# EAGLE design NT_MCUModule (EAGLE 9.5.1)
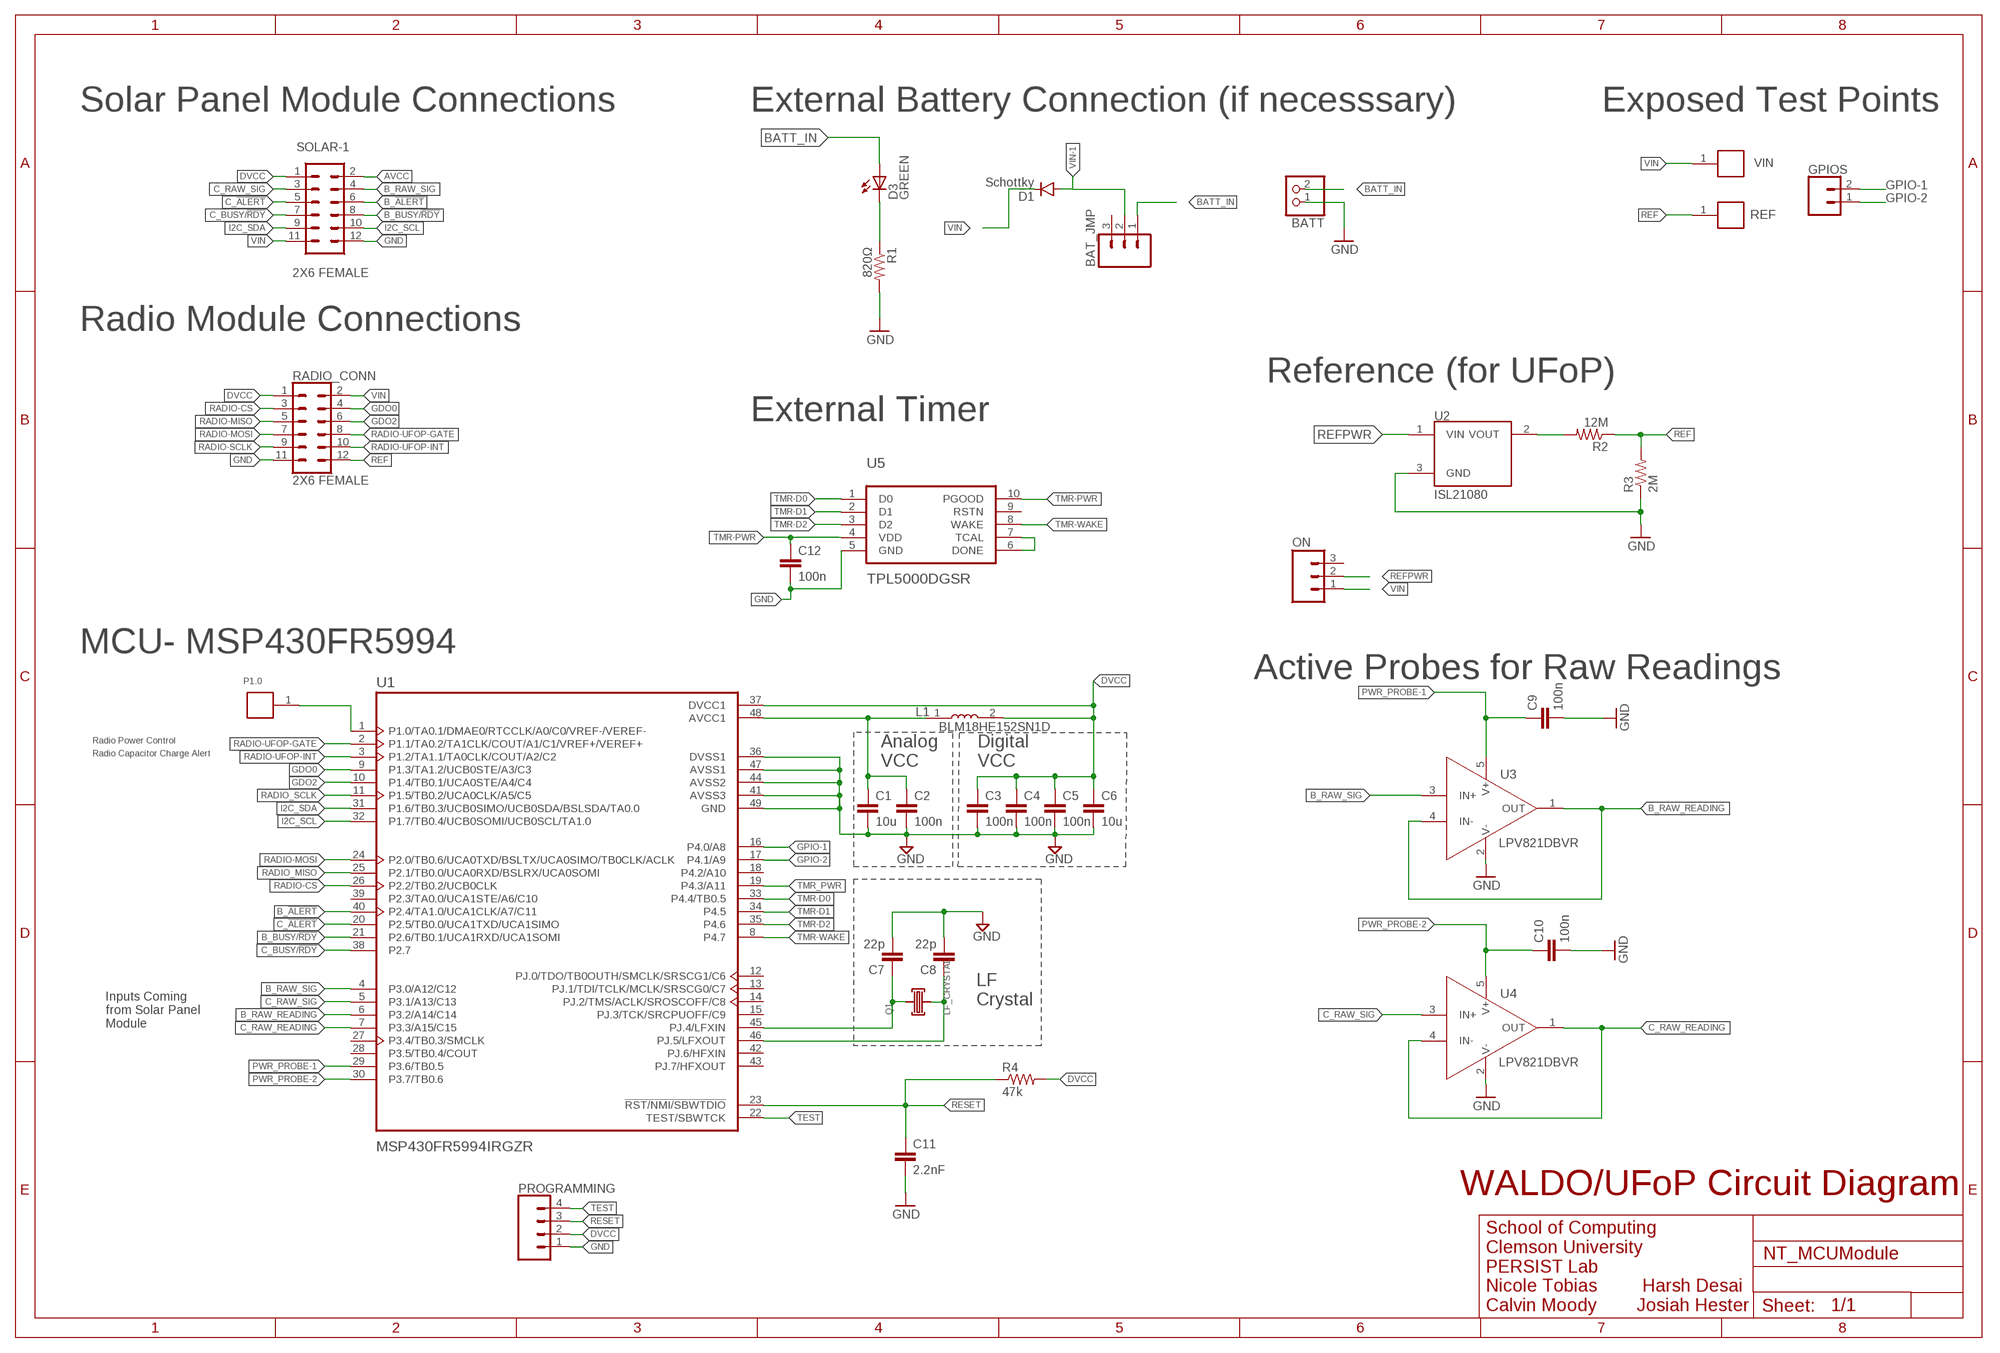
[diagram p0: schematic, sheet 1]

## Parts
BAT_JMP  M03  [1X03-1.27MM]
BATT  PINHD-1X2  [1X02]
C1  10u  C-EUC0603  [C0603]
C2  100n  C-EUC0603  [C0603]
C3  100n  C-EUC0603  [C0603]
C4  100n  C-EUC0603  [C0603]
C5  100n  C-EUC0603  [C0603]
C6  10u  C-EUC0603  [C0603]
C7  22p  C-EUC0603  [C0603]
C8  22p  C-EUC0603  [C0603]
C9  100n  C-EUC0603  [C0603]
C10  100n  C-EUC0603  [C0603]
C11  2.2nF  C-EUC0603  [C0603]
C12  100n  C-EUC0603  [C0603]
D1  Schottky  DIODESOD523  [SOD523]
D3  GREEN  LEDCHIP-LED0805  [CHIP-LED0805]
GPIOS  CONN_02  [1X02]
L1  BLM18HE152SN1D  [INDC1608X95]
ON  M03  [1X03-1.27MM]
P1.0  RCU-0C  [TE_RCU-0C]
PROGRAMMING  CONN_04  [1X04]
Q1  LF_CRYSTAL  [LF_CRYSTAL]
R1  820Ω  RESISTOR0603  [0603-RES]
R2  12M  RESISTOR0603-RES  [0603-RES]
R3  2M  RESISTOR0603-RES  [0603-RES]
R4  47k  RESISTOR0603-RES  [0603-RES]
RADIO_CONN  2X6 FEMALE  CONN_06X2PTH_FEMALE  [2X6]
REF  RCU-0C  [TE_RCU-0C]
SOLAR-1  2X6 FEMALE  M06X2PTH_FEMALE  [2X6]
U1  MSP430FR5994IRGZR  [QFN50P700X700X100-49N]
U2  ISL21080  [SOT-23]
U3  LPV821DBVR  [SOT95P280X145-5N]
U4  LPV821DBVR  [SOT95P280X145-5N]
U5  TPL5000DGSR  [SOP50P490X110-10N]
VIN  RCU-0C  [TE_RCU-0C]

## Nets
AVCC: C1.1 C2.1 L1.1 SOLAR-1.2 U1.48(AVCC1)
B_!ALERT: SOLAR-1.6 U1.40(P2.4/TA1.0/UCA1CLK/A7/C11)
B_BUSY/!RDY: SOLAR-1.8 U1.21(P2.6/TB0.1/UCA1RXD/UCA1SOMI)
B_RAW_READING: U1.6(P3.2/A14/C14) U3.1(OUT) U3.4(IN-)
B_RAW_SIG: SOLAR-1.4 U1.4(P3.0/A12/C12) U3.3(IN+)
BATT_IN: BAT_JMP.1 BATT.2 D3.A
C_!ALERT: SOLAR-1.5 U1.20(P2.5/TB0.0/UCA1TXD/UCA1SIMO)
C_BUSY/!RDY: SOLAR-1.7 U1.38(P2.7)
C_RAW_READING: U1.7(P3.3/A15/C15) U4.1(OUT) U4.4(IN-)
C_RAW_SIG: SOLAR-1.3 U1.5(P3.1/A13/C13) U4.3(IN+)
DVCC: C3.1 C4.1 C5.1 C6.1 L1.2 PROGRAMMING.2 R4.2 RADIO_CONN.1 SOLAR-1.1 U1.37(DVCC1)
GDO0: RADIO_CONN.4 U1.9(P1.3/TA1.2/UCB0STE/A3/C3)
GDO2: RADIO_CONN.6 U1.10(P1.4/TB0.1/UCA0STE/A4/C4)
GND: BATT.1 C1.2 C2.2 C3.2 C4.2 C5.2 C6.2 C7.2 C8.2 C9.2 C10.2 C11.2 C12.2 PROGRAMMING.1 R1.2 R3.1 RADIO_CONN.11 SOLAR-1.12 U1.36(DVSS1) U1.41(AVSS3) U1.44(AVSS2) U1.47(AVSS1) U1.49(GND) U2.3(GND) U3.2(V-) U4.2(V-) U5.5(GND)
GPIO-1: GPIOS.2 U1.16(P4.0/A8)
GPIO-2: GPIOS.1 U1.17(P4.1/A9)
I2C_SCL: SOLAR-1.10 U1.32(P1.7/TB0.4/UCB0SOMI/UCB0SCL/TA1.0)
I2C_SDA: SOLAR-1.9 U1.31(P1.6/TB0.3/UCB0SIMO/UCB0SDA/BSLSDA/TA0.0)
N$1: P1.0.1 U1.1(P1.0/TA0.1/DMAE0/RTCCLK/A0/C0/VREF-/VEREF-)
N$3: U5.6(DONE) U5.7(TCAL)
N$11: D3.C R1.1
N$12: R2.2 U2.2(VOUT)
N$19: C8.1 Q1.2 U1.46(PJ.5/LFXOUT)
N$22: C7.1 Q1.1 U1.45(PJ.4/LFXIN)
PWR_PROBE-1: C9.1 U1.29(P3.6/TB0.5) U3.5(V+)
PWR_PROBE-2: C10.1 U1.30(P3.7/TB0.6) U4.5(V+)
RADIO-CS: RADIO_CONN.3 U1.26(P2.2/TB0.2/UCB0CLK)
RADIO-MISO: RADIO_CONN.5
RADIO-MOSI: RADIO_CONN.7 U1.24(P2.0/TB0.6/UCA0TXD/BSLTX/UCA0SIMO/TB0CLK/ACLK)
RADIO-SCLK: RADIO_CONN.9
RADIO-UFOP-GATE: RADIO_CONN.8 U1.2(P1.1/TA0.2/TA1CLK/COUT/A1/C1/VREF+/VEREF+)
RADIO-UFOP-INT: RADIO_CONN.10 U1.3(P1.2/TA1.1/TA0CLK/COUT/A2/C2)
RADIO_MISO: U1.25(P2.1/TB0.0/UCA0RXD/BSLRX/UCA0SOMI)
RADIO_SCLK: U1.11(P1.5/TB0.2/UCA0CLK/A5/C5)
REF: R2.1 R3.2 RADIO_CONN.12 REF.1
REFPWR: ON.2 U2.1(VIN)
RESET: C11.1 PROGRAMMING.3 R4.1 U1.23(!RST/NMI/SBWTDIO)
TEST: PROGRAMMING.4 U1.22(TEST/SBWTCK)
TMR-D0: U1.33(P4.4/TB0.5) U5.1(D0)
TMR-D1: U1.34(P4.5) U5.2(D1)
TMR-D2: U1.35(P4.6) U5.3(D2)
TMR-PWR: C12.1 U5.4(VDD) U5.10(PGOOD)
TMR-WAKE: U1.8(P4.7) U5.8(WAKE)
TMR_PWR: U1.19(P4.3/A11)
VIN: D1.C ON.1 RADIO_CONN.2 SOLAR-1.11 VIN.1
VIN-1: BAT_JMP.2 D1.A
Unconnected: BAT_JMP.3 ON.3 U1.12(PJ.0/TDO/TB0OUTH/SMCLK/SRSCG1/C6) U1.13(PJ.1/TDI/TCLK/MCLK/SRSCG0/C7) U1.14(PJ.2/TMS/ACLK/SROSCOFF/C8) U1.15(PJ.3/TCK/SRCPUOFF/C9) U1.18(P4.2/A10) U1.27(P3.4/TB0.3/SMCLK) U1.28(P3.5/TB0.4/COUT) U1.39(P2.3/TA0.0/UCA1STE/A6/C10) U1.42(PJ.6/HFXIN) U1.43(PJ.7/HFXOUT) U5.9(RSTN)

## Notes on the sheet
- Solar Panel Module Connections | External Battery Connection (if necesssary) | Exposed Test Points
- Radio Module Connections
- Reference (for UFoP)
- External Timer
- MCU- MSP430FR5994
- Active Probes for Raw Readings
- Radio Power Control
- Analog | Digital
- Radio Capacitor Charge Alert
- VCC | VCC
- LF
- Crystal
- Inputs Coming 
  from Solar Panel
  Module
- WALDO/UFoP Circuit Diagram
- School of Computing
  Clemson University
  PERSIST Lab
  Nicole Tobias         Harsh Desai
  Calvin Moody        Josiah Hester

## Library data of the parts
BAT_JMP ON = SparkFun-Connectors:M03: Header 3 Standard 3-pin 0.1" header. Use with straight break away headers (SKU : PRT-00116), right angle break away headers (PRT-00553), swiss pins (PRT-00743), machine pins (PRT-00117), and female headers (PRT-00115). Molex polarized connector foot print use with SKU : PRT-08232 with associated crimp pins and housings.
BATT = pinhead:PINHD-1X2: PIN HEADER
C1-C12 = rcl:C-EU: CAPACITOR, European symbol
D1 = SparkFun-DiscreteSemi:DIODE: Diode These are standard reverse protection diodes and small signal diodes. SMA package can handle up to about 1A. SOD-323 can handle about 200mA. What the SOD-323 package when ordering, there are some mfgs out there that are 5-pin packages.
D3 = led:LED: LED OSRAM: - CHIPLED LG R971, LG N971, LY N971, LG Q971, LY Q971, LO R971, LY R971 LH N974, LH R974 LS Q976, LO Q976, LY Q976 LO Q996 - Hyper CHIPLED LW Q18S LB Q993, LB Q99A, LB R99A - SideLED LS A670, LO A670, LY A670, LG A670, LP A670 LB A673, LV A673, LT A673, LW A673 LH A674 LY A675 LS A676, LA A676, LO A676, LY A676, LW A676 LS A679, LY A679, LG A679 - Hyper Micro SIDELED® LS Y876, LA Y876, LO Y876, LY Y876 LT Y87S - SmartLED LW L88C, LW L88S LB L89C, LB L89S, LG L890 LS L89K, LO L89K, LY L89K LS L896, LA L896, LO L896, LY L896 - TOPLED LS T670, LO T670, LY T670, LG T670, LP T670 LSG T670, LSP T670, LSY T670, LOP T670, LYG T670 LG T671, LOG T671, LSG T671 LB T673, LV T673, LT T673, LW T673 LH T674 LS T676, LA T676, LO T676, LY T676, LB T676, LH T676, LSB T676, LW T676 LB T67C, LV T67C, LT T67C, LS T67K, LO T67K, LY T67K, LW E67C LS E67B, LA E67B, LO E67B, LY E67B, LB E67C, LV E67C, LT E67C LW T67C LS T679, LY T679, LG T679 LS T770, LO T770, LY T770, LG T770, LP T770 LB T773, LV T773, LT T773, LW T773 LH T774 LS E675, LA E675, LY E675, LS T675 LS T776, LA T776, LO T776, LY T776, LB T776 LHGB T686 LT T68C, LB T68C - Hyper Mini TOPLED® LB M676 - Mini TOPLED Santana® LG M470 LS M47K, LO M47K, LY M47K Source: http://www.osram.convergy.de LUXEON: - LUMILED® LXK2-PW12-R00, LXK2-PW12-S00, LXK2-PW14-U00, LXK2-PW14-V00 LXK2-PM12-R00, LXK2-PM12-S00, LXK2-PM14-U00 LXK2-PE12-Q00, LXK2-PE12-R00, LXK2-PE12-S00, LXK2-PE14-T00, LXK2-PE14-U00 LXK2-PB12-K00, LXK2-PB12-L00, LXK2-PB12-M00, LXK2-PB14-N00, LXK2-PB14-P00, LXK2-PB14-Q00 LXK2-PR12-L00, LXK2-PR12-M00, LXK2-PR14-Q00, LXK2-PR14-R00 LXK2-PD12-Q00, LXK2-PD12-R00, LXK2-PD12-S00 LXK2-PH12-R00, LXK2-PH12-S00 LXK2-PL12-P00, LXK2-PL12-Q00, LXK2-PL12-R00 Source: www.luxeon.com KINGBRIGHT: KA-3528ASYC Source: www.kingbright.com
GPIOS = SparkFun-Connectors:CONN_02: Multi connection point. Often used as Generic Header-pin footprint for 0.1 inch spaced/style header connections On any of the 0.1 inch spaced packages, you can populate with these: Break Away Headers - Straight <https://www.sparkfun.com/products/116> (PRT-00116) Break Away Male Headers - Right Angle <https://www.sparkfun.com/products/553> (PRT-00553) Female Headers <https://www.sparkfun.com/products/115> (PRT-00115) Break Away Headers - Machine Pin <https://www.sparkfun.com/products/117> (PRT-00117) Break Away Female Headers - Swiss Machine Pin <https://www.sparkfun.com/products/743> (PRT-00743) For SCREWTERMINALS and SPRING TERMINALS visit here: Screw Terimnals on SparkFun.com <https://www.sparkfun.com/search/results?term=Screw+Terminals> (5mm/3.5mm/2.54mm spacing) This device is also useful as a general connection point to wire up your design to another part of your project. Our various solder wires solder well into these plated through hole pads. Hook-Up Wire - Assortment (Stranded, 22 AWG) <https://www.sparkfun.com/products/11375> (PRT-11375) Hook-Up Wire - Assortment (Solid Core, 22 AWG) <https://www.sparkfun.com/products/11367> (PRT-11367) View the entire wire category on our website here <https://www.sparkfun.com/categories/141> Special notes: Molex polarized connector foot print use with: PRT-08233 with associated crimp pins and housings. 2.54_SCREWTERM for use with PRT-10571. 3.5mm Screw Terminal footprints for PRT-08084 5mm Screw Terminal footprints for use with PRT-08432
L1 = BLM18HE152SN1D:BLM18HE152SN1D: Ferrite Beads Multi-Layer 1.5KOhm 25% 100MHz 500mA 500mOhm DCR 0603 T/R; DESCRIPTION: Ferrite Beads Multi-Layer 1.5KOhm 25% 100MHz 500mA 500mOhm DCR 0603 Paper T/R; DIGI-KEY_PART_NUMBER: 490-5216-1-ND; DIGI-KEY_PURCHASE_URL: https://www.digikey.com/product-detail/en/murata-electronics-north-america/BLM18HE152SN1D/490-5216-1-ND/1948392?utm_source=snapeda&utm_medium=aggregator&utm_campaign=symbol; MF: Murata; MP: BLM18HE152SN1D; PACKAGE: 0603 Murata
P1.0 REF VIN = RCU-0C:RCU-0C: 0603 PROBE PAD; AVAILABILITY: Unavailable; COMMENT: RCU-0C _1625854-3_; DESCRIPTION: 0603 PROBE PAD; EU_ROHS_COMPLIANCE: Compliant; LINK: http://www.te.com/usa-en/product-1625854-3.html; MF: TE Connectivity; MP: RCU-0C; PACKAGE: 0603; POWER_RATING: 0 W; PRICE: None; RESISTANCE: <.05; TOLERANCE: 0%
PROGRAMMING = SparkFun-Connectors:CONN_04: Multi connection point. Often used as Generic Header-pin footprint for 0.1 inch spaced/style header connections On any of the 0.1 inch spaced packages, you can populate with these: Break Away Headers - Straight <https://www.sparkfun.com/products/116> (PRT-00116) Break Away Male Headers - Right Angle <https://www.sparkfun.com/products/553> (PRT-00553) Female Headers <https://www.sparkfun.com/products/115> (PRT-00115) Break Away Headers - Machine Pin <https://www.sparkfun.com/products/117> (PRT-00117) Break Away Female Headers - Swiss Machine Pin <https://www.sparkfun.com/products/743> (PRT-00743) For SCREWTERMINALS and SPRING TERMINALS visit here: Screw Terimnals on SparkFun.com <https://www.sparkfun.com/search/results?term=Screw+Terminals> (5mm/3.5mm/2.54mm spacing) This device is also useful as a general connection point to wire up your design to another part of your project. Our various solder wires solder well into these plated through hole pads. Hook-Up Wire - Assortment (Stranded, 22 AWG) <https://www.sparkfun.com/products/11375> (PRT-11375) Hook-Up Wire - Assortment (Solid Core, 22 AWG) <https://www.sparkfun.com/products/11367> (PRT-11367) View the entire wire category on our website here <https://www.sparkfun.com/categories/141> Special notes: Molex polarized connector foot print use with SKU : PRT-08231 with associated crimp pins and housings. 1MM SMD Version SKU: PRT-10208; PROD_ID: CONN-09696
Q1 = MSP_IC:LF_CRYSTAL
R1 = SparkFun-Resistors:RESISTOR: Resistor Basic schematic elements and footprints for 0603, 1206, and PTH resistors.
R2 = SparkFun-Resistors:RESISTOR: Resistor Basic schematic elements and footprints for 0603, 1206, and PTH resistors.; DIGIKEY: 541-6.20MHCT-ND
R3 R4 = SparkFun-Resistors:RESISTOR: Resistor Basic schematic elements and footprints for 0603, 1206, and PTH resistors.; DIGIKEY: 311-1.00MHRCT-ND
RADIO_CONN = SparkFun-Connectors:CONN_06X2: Multi connection point. Often used as Generic Header-pin footprint for 0.1 inch spaced/style header connections On any of the 0.1 inch spaced packages, you can populate with these: Break Away Headers - Straight <https://www.sparkfun.com/products/116> (PRT-00116) Break Away Male Headers - Right Angle <https://www.sparkfun.com/products/553> (PRT-00553) Female Headers <https://www.sparkfun.com/products/115> (PRT-00115) Break Away Headers - Machine Pin <https://www.sparkfun.com/products/117> (PRT-00117) Break Away Female Headers - Swiss Machine Pin <https://www.sparkfun.com/products/743> (PRT-00743); PROD_ID: CONN-12423
SOLAR-1 = SparkFun-Connectors:M06X2; PROD_ID: CONN-12423
U1 = MSP430FR5994IRGZR:MSP430FR5994IRGZR: None; AVAILABILITY: Unavailable; DESCRIPTION: 16 MHz Ultra-Low-Power MCU With 256 KB FRAM, 8 KB SRAM, Low-Energy Vector Math Accelerator 48-VQFN -40 to 85; MF: Texas Instruments; MP: MSP430FR5994IRGZR; PACKAGE: VQFN-48 Texas Instruments; PRICE: None
U2 = isl21080:ISL21080: Intersil: ISL21080, 300nA NanoPower Voltage References The ISL21080 analog voltage references feature low supply voltage operation at ultra-low 310nA typ, 1.5µA max operating current. Additionally, the ISL21080 family features guaranteed initial accuracy as low as ±0.2% and 50ppm/°C temperature coefficient. These references are ideal for general purpose portable applications to extend battery life at lower cost. The ISL21080 is provided in the industry standard 3 Ld SOT-23 pinout. The ISL21080 output voltages can be used as precision voltage sources for voltage monitors, control loops, standby voltages for low power states for DSP, FPGA, Datapath Controllers, microcontrollers and other core voltages: 0.9V, 1.024V, 1.25V, 1.5V, 2.048V, 2.5V, 3.0V, 3.3V, 4.096V and 5.0V. Special Note: Post-assembly x-ray inspection may lead to permanent changes in device output voltage and should be minimized or avoided. For further information, please see “Applications Information” on page 14 and AN1533, “X-Ray Effects on Intersil FGA References”.; DIGIKEY: ISL21080DIH309Z-TKCT-ND
U3 U4 = LPV821DBVR:LPV821DBVR: LPV821 Precision Nanopower Zero-Drift Amplifier 1.7V to 3.6V 5-Pin SOT-23 T/R; DESCRIPTION: LPV821 Precision Nanopower Zero-Drift Amplifier 1.7V to 3.6V 5-Pin SOT-23 T/R; DIGI-KEY_PART_NUMBER: 296-47911-1-ND; DIGI-KEY_PURCHASE_URL: https://www.digikey.com/product-detail/en/texas-instruments/LPV821DBVR/296-47911-1-ND/8211750?utm_source=snapeda&utm_medium=aggregator&utm_campaign=symbol; MF: Texas Instruments; MP: LPV821DBVR; PACKAGE: SOT-23 Texas Instruments
U5 = TPL5000DGSR:TPL5000DGSR: None; AVAILABILITY: Unavailable; DESCRIPTION: Nano Power Programmable Timer with Watchdog Functionality 10-VSSOP -40 to 105; MF: Texas Instruments; MP: TPL5000DGSR; PACKAGE: TFSOP-10 Texas Instruments; PRICE: None

## Board
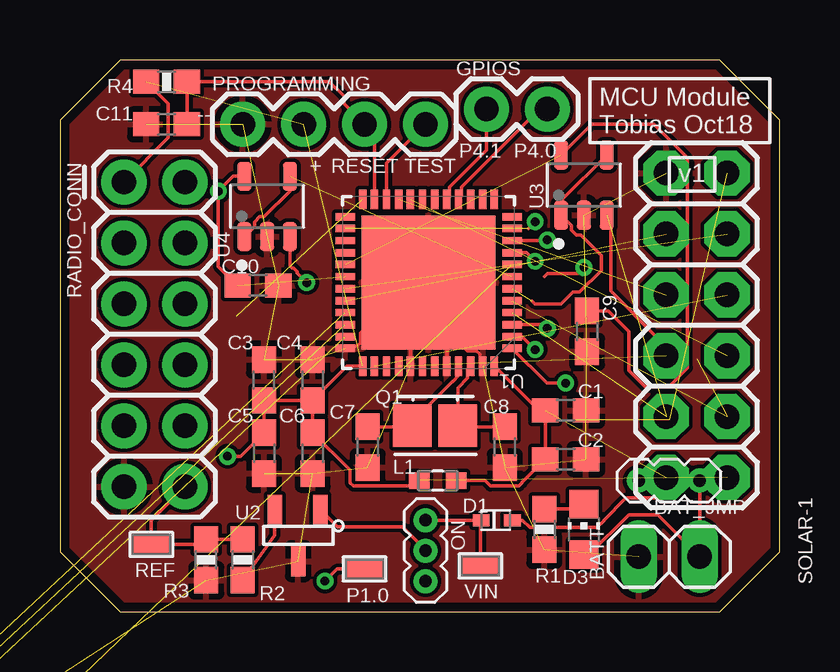
[diagram p1: board, top side]
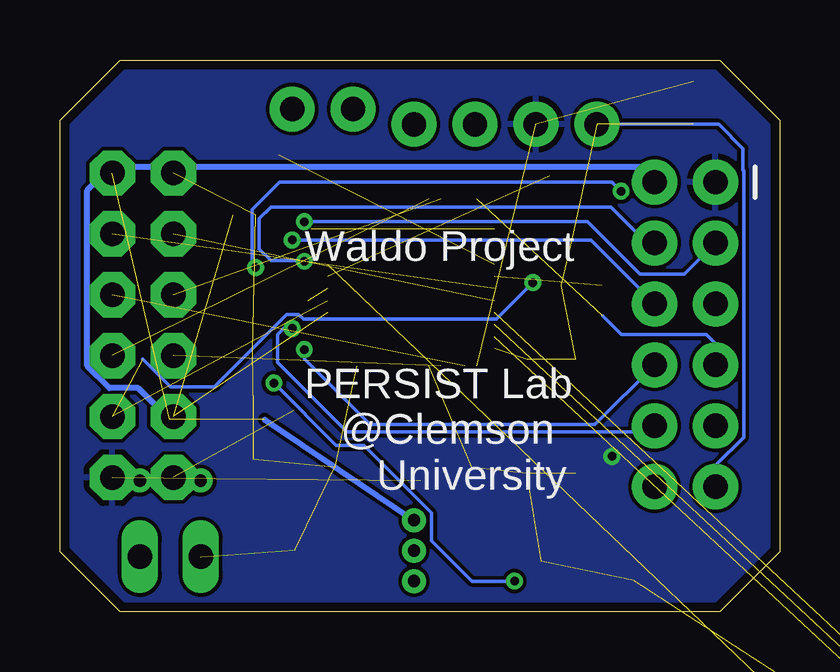
[diagram p2: board, bottom side, seen from below]

Size 30 x 23 mm. Coordinates in mm from the lower left corner, seen from the top.
Outline: 30,2.5 30,20.5 27.5,23 2.5,23 0,20.5 0,2.5 2.5,0 27.5,0 30,2.5
Copper layers (1*16): Top 0.0356mm / dielectric 1.5011mm / Bottom 0.0356mm
Design rules "oshpark-2layer *": minimum track width 6mil, minimum drill 13mil, track to track 6mil, track to pad 6mil, pad to pad 6mil, via to via 6mil, smd to smd 6mil, copper to edge 15mil, drill to drill 6mil, minimum pad ring 7mil, minimum via ring 7mil, stop-mask expansion 2.5mil, vias tented up to drill 14mil, thermal gap 10mil

### Footprints (pad centres in the part's own frame; a part is rotated, then mirrored left to right if it is on the bottom)
1X03-1.27MM = drill 0.508 pad 1: 1 -1.27,0; 2 0,0; 3 1.27,0
1X02 = drill 1.016 long: 1 -1.27,0; 2 1.27,0
C0603 = smd 1.1 x 1: 1 -0.85,0; 2 0.85,0
SOD523 = smd 0.7 x 0.5: A 0.7,0; C -0.6,0
CHIP-LED0805 = smd 1.2 x 1.2: A 0,-1.05; C 0,1.05
1X02' = drill 1.016 pad 1.88: 1 0,0; 2 2.54,0
INDC1608X95 = smd 0.85 x 0.7: 1 -0.775,0; 2 0.775,0
TE_RCU-0C = smd 1.6 x 0.8: 1 0,0
1X04 = drill 1.016 pad 1.88: 1 0,0; 2 2.54,0; 3 5.08,0; 4 7.62,0
LF_CRYSTAL = smd 1.778 x 1.6: 1 0,0.94; 2 0,-0.965
0603-RES = smd 1.1 x 1: 1 -0.85,0; 2 0.85,0
2X6 = drill 1.016 pad 1.88: 1 0,0; 2 0,2.54; 3 2.54,0; 4 2.54,2.54; 5 5.08,0; 6 5.08,2.54; 7 7.62,0; 8 7.62,2.54; 9 10.16,0; 10 10.16,2.54; 11 12.7,0; 12 12.7,2.54
2X6' = drill 1.016 pad 1.88 octagon: 1 0,0; 2 0,2.54; 3 2.54,0; 4 2.54,2.54; 5 5.08,0; 6 5.08,2.54; 7 7.62,0; 8 7.62,2.54; 9 10.16,0; 10 10.16,2.54; 11 12.7,0; 12 12.7,2.54
QFN50P700X700X100-49N = smd 0.813 x 0.305: 1 -3.48,2.743; 2 -3.48,2.261; 3 -3.48,1.753; 4 -3.48,1.245; 5 -3.48,0.762; 6 -3.48,0.254; 7 -3.48,-0.254; 8 -3.48,-0.762; 9 -3.48,-1.245; 10 -3.48,-1.753; 11 -3.48,-2.261; 12 -3.48,-2.743; 25 3.48,-2.743; 26 3.48,-2.261; 27 3.48,-1.753; 28 3.48,-1.245; 29 3.48,-0.762; 30 3.48,-0.254; 31 3.48,0.254; 32 3.48,0.762; 33 3.48,1.245; 34 3.48,1.753; 35 3.48,2.261; 36 3.48,2.743 | smd 0.305 x 0.813: 13 -2.743,-3.48; 14 -2.261,-3.48; 15 -1.753,-3.48; 16 -1.245,-3.48; 17 -0.762,-3.48; 18 -0.254,-3.48; 19 0.254,-3.48; 20 0.762,-3.48; 21 1.245,-3.48; 22 1.753,-3.48; 23 2.261,-3.48; 24 2.743,-3.48; 37 2.743,3.48; 38 2.261,3.48; 39 1.753,3.48; 40 1.245,3.48; 41 0.762,3.48; 42 0.254,3.48; 43 -0.254,3.48; 44 -0.762,3.48; 45 -1.245,3.48; 46 -1.753,3.48; 47 -2.261,3.48; 48 -2.743,3.48 | smd 5.588 x 5.588: 49 0,0
SOT-23 = smd 0.6 x 1.25: 1 -0.95,-1.075; 2 0.95,-1.075; 3 -0.025,1.075
SOT95P280X145-5N = smd 1.21 x 0.59: 1 -1.255,0.95; 2 -1.255,0; 3 -1.255,-0.95; 4 1.255,-0.95; 5 1.255,0.95
SOP50P490X110-10N = smd 1.47 x 0.28: 1 -2.15,1; 2 -2.15,0.5; 3 -2.15,0; 4 -2.15,-0.5; 5 -2.15,-1; 6 2.15,-1; 7 2.15,-0.5; 8 2.15,0; 9 2.15,0.5; 10 2.15,1

### Placement (x,y rotation side)
BAT_JMP  25.4,5.46 180 top
BATT  25.4,2.29 0 top
C1  21.08,8.38 0 top
C2  21.08,6.35 0 top
C3  8.51,9.65 90 top
C4  10.54,9.65 90 top
C5  8.51,6.6 270 top
C6  10.54,6.6 270 top
C7  12.83,6.86 270 top
C8  18.54,6.86 270 top
C9  21.97,11.68 270 top
C10  8.26,13.59 0 top
C11  4.45,20.32 180 top
C12  -6.35,-12.7 0 top  (outside the outline)
D1  18.16,3.81 0 top
D3  21.84,3.43 0 top
GPIOS  [1X02']  17.78,20.95 0 top
L1  15.75,5.46 180 top
ON  15.24,2.54 270 top
P1.0  12.7,1.78 0 top
PROGRAMMING  7.62,20.32 0 top
Q1  15.62,7.75 90 top
R1  20.19,3.43 270 top
R2  7.62,2.16 270 top
R3  6.1,2.16 90 top
R4  4.45,22.1 180 top
RADIO_CONN  2.67,17.91 270 top
REF  3.81,2.79 180 top
SOLAR-1  2X6 FEMALE  [2X6']  27.81,5.59 90 top
U1  15.37,13.72 180 top
U2  9.91,3.17 180 top
U3  21.84,17.78 90 top
U4  8.64,16.89 90 top
U5  -5.08,-6.35 0 top  (outside the outline)
VIN  17.53,1.91 180 top

### Tracks (layer width: path | path; a pad name or v marks a point on that pad's centre or on a via)
AVCC  (1 unrouted)
  Top 0.152: U1.48 19.96,8.38 C1.1 C2.1 19.27,5.39 19.27,5.36 19.14,5.23 17.95,5.23 17.72,5.46 L1.1
B_!ALERT  (1 unrouted)
B_BUSY/!RDY  (1 unrouted)
B_RAW_READING  (1 unrouted)
  Top 0.152: 19.68,12.95 19.81,12.83 20.89,12.83 21.38,13.31 21.66,13.31 22.58,14.23 22.58,14.84 21.73,15.69 21.54,15.69 21.32,15.91 21.32,16.1 20.93,16.49 | 20.93,16.49 U3.1 | U3.4 20.95,17.2 20.95,16.51 20.93,16.49
B_RAW_SIG  (2 unrouted)
  Top 0.152: U3.3 22.96,16.36 22.96,13.36 24.89,11.43
BATT_IN
  Top 0.152: BAT_JMP.1 BATT.2 24.92,4.04 23.72,4.04 22.06,2.38 D3.A
C_!ALERT  (1 unrouted)
C_BUSY/!RDY  (1 unrouted)
C_RAW_READING  (1 unrouted)
  Top 0.152: U4.4 9.59,17.54 8.52,16.47 8.33,16.47 8.11,16.25 8.11,16.06 U4.1
C_RAW_SIG  (via drill 0.35)  (2 unrouted)
  Top 0.152: U4.3 9.59,14.42 9.69,14.32 9.75,14.32 9.88,14.18 9.88,14.12 v10.29,13.72
  Bottom 0.152: v10.29,13.72 11.81,12.19 19.84,12.19 20.04,12.39 20.56,12.39 23.58,9.37 25.38,9.37 26.54,10.54
DVCC  (via drill 0.35)  (3 unrouted)
  Top 0.152: C4.1 C3.1 C5.1 7.53,6.48 v6.99,6.48 | C4.1 C6.1 12.1,5.9 12.1,5.36 12.23,5.23 14.74,5.23 L1.2 | C4.1 11.97,10.24 U1.37 | RADIO_CONN.1 4.52,19.76 4.52,21.18 R4.2
  pour Bottom: -8.89,31.75 38.1,31.75 38.1,-2.54 -8.89,-2.54
GDO0  (via drill 0.35)
  Top 0.152: U1.9 19.46,14.96 v19.81,14.61
  Bottom 0.152: RADIO_CONN.4 5.54,15.37 7.04,16.86 21.21,16.86 21.69,16.38 21.69,15.12 21.21,14.63 19.84,14.63 v19.81,14.61
GDO2  (via drill 0.35)
  Top 0.152: U1.10 20.3,15.47 v20.32,15.49
  Bottom 0.152: RADIO_CONN.6 7.87,15.49 v20.32,15.49
GND  (21 unrouted)
  Top 0.152: U1.49 15.37,12.5 16.99,10.87 17.37,10.87 17.5,10.74 17.5,10.36 U1.47 | U1.44 16.13,12.95 U1.49 | U1.41 14.61,12.95 U1.49 | U1.49 14.63,13.72 12.52,11.61 12.52,11.21 12.39,11.07 11.99,11.07 U1.36
  Bottom 0.152: RADIO_CONN.11 2.67,6.09 1.5,7.26 1.5,18.39 1.52,18.42 1.52,19.3 2.54,20.32 PROGRAMMING.1
  pour Top: -6.35,-1.27 36.83,-1.27 36.83,33.02 -6.35,33.02
GPIO-1
  Top 0.152: U1.16 16.74,17.32 16.74,17.7 20,20.95 GPIOS.2
GPIO-2
  Top 0.152: U1.17 16.23,17.3 16.23,17.7 17.78,19.25 GPIOS.1
I2C_SCL  (1 unrouted)
I2C_SDA  (1 unrouted)
N$1  (via drill 0.35)
  Top 0.152: U1.1 20.3,9.53 v21.08,9.53 | v11.05,1.27 11.56,1.78 P1.0.1
  Bottom 0.152: v21.08,9.53 18.48,6.93 17.32,6.93 14.51,4.11 14.51,2.95 12.83,1.27 v11.05,1.27
N$3  (1 unrouted)
N$11
  Top 0.152: R1.1 21.64,4.28 D3.C
N$12
  Top 0.152: U2.2 8.96,3.19 R2.2
N$19
  Top 0.152: C8.1 16.62,7.71 Q1.2 16.59,9.33 16.99,9.73 16.99,10.11 U1.46
N$22
  Top 0.152: 14.48,7.71 C7.1 | 14.48,7.71 14.64,7.71 Q1.1 | 14.48,7.71 16.37,9.6 16.38,9.6 16.61,9.84 U1.45
PWR_PROBE-1  (1 unrouted)
  Top 0.152: 21.91,12.47 C9.1 22.86,12.53 23.72,11.67 23.72,10.06 24.41,9.37 25.38,9.37 26.16,10.16 26.16,18.92 24.77,20.32 22.18,20.32 U3.5
PWR_PROBE-2  (via drill 0.35)  (1 unrouted)
  Top 0.152: U4.5 7.22,18.15 v6.6,17.53 6.6,14.39 C10.1 | 20.19,13.97 20.32,14.1 21.59,14.1 v21.84,14.35
  Bottom 0.152: v21.84,14.35 21.99,14.5 21.99,16.76 20.85,17.91 6.99,17.91 v6.6,17.53
RADIO-CS  (via drill 0.35)  (1 unrouted)
  Top 0.152: v19.81,16.26 19.53,15.98
  Bottom 0.152: v19.81,16.26 8,16.26 5.82,14.07 3.96,14.07 RADIO_CONN.3
RADIO-MOSI  (1 unrouted)
  Bottom 0.152: 7.37,12.32 6.6,11.56 3.05,11.56 2.67,11.18 RADIO_CONN.7
RADIO-UFOP-GATE  (via drill 0.35)
  Top 0.152: U1.2 19.28,11.46 v19.81,10.92
  Bottom 0.152: v19.81,10.92 19.81,10.54 17.07,7.8 7.7,7.8 RADIO_CONN.8
RADIO-UFOP-INT  (via drill 0.35)
  Top 0.152: U1.3 20.17,11.96 v20.32,11.81
  Bottom 0.152: v20.32,11.81 20.67,11.81 20.93,11.55 20.93,10.39 18.03,7.49 5.46,7.49 RADIO_CONN.10
REF
  Top 0.152: R2.1 R3.2 5.88,2.79 REF.1 3.81,3.81 RADIO_CONN.12
REFPWR
  Top 0.152: U2.1 11.57,3.53 14.28,3.53 15.24,2.57 ON.2
RESET
  Top 0.152: U1.23 13.11,19.91 PROGRAMMING.3 11.84,21.18 11.84,21.49 11.23,22.1 R4.1 C11.1
TEST
  Top 0.152: U1.22 13.61,18.69 PROGRAMMING.4
TMR-D0  (1 unrouted)
TMR-D1  (1 unrouted)
TMR-D2  (1 unrouted)
TMR-PWR  (2 unrouted)
TMR-WAKE  (1 unrouted)
VIN  (2 unrouted)
  Top 0.152: VIN.1 17.53,3.77 D1.C ON.1
  Bottom 0.254: 21.46,8 ON.1 | RADIO_CONN.2 5.84,18.54 27.89,18.54 28.86,17.57 28.86,10.24 27.94,9.32 26.75,9.32 25.43,8
VIN-1
  Top 0.152: D1.A 19.29,3.81 19.6,3.5 22.39,3.5 22.67,3.78 22.67,3.81 23.59,4.73 24.94,4.73 25.4,5.19 BAT_JMP.2

### Text on the board
tPlace: -- | MCU Module / Tobias Oct18 | P4.1 | P4.0 | + | RESET | TEST | v1 | P1.0
bPlace: Waldo Project / / / PERSIST Lab / @Clemson / University